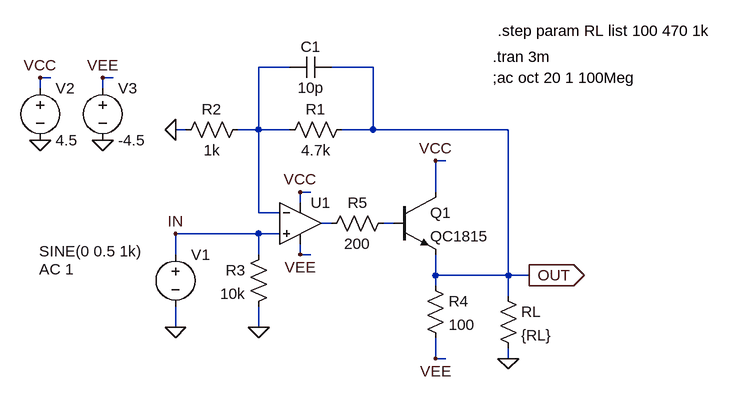
[diagram p0: schematic EmitterFollower+OPAMP+R.asc]
EmitterFollower+OPAMP+R.asc, the LTspice schematic file:
Version 4
SHEET 1 880 680
WIRE 128 -64 80 -64
WIRE 256 -64 192 -64
WIRE -240 -48 -256 -48
WIRE -144 -48 -160 -48
WIRE -256 -32 -256 -48
WIRE -160 -32 -160 -48
WIRE -32 32 -48 32
WIRE 80 32 80 -64
WIRE 80 32 48 32
WIRE 128 32 80 32
WIRE 256 32 256 -64
WIRE 256 32 208 32
WIRE 464 32 256 32
WIRE 368 80 352 80
WIRE 160 128 144 128
WIRE 352 128 352 80
WIRE 144 144 144 128
WIRE 80 160 80 32
WIRE 112 160 80 160
WIRE 192 176 176 176
WIRE 288 176 272 176
WIRE 80 192 -48 192
WIRE 112 192 80 192
WIRE -48 224 -48 192
WIRE 80 224 80 192
WIRE 144 224 144 208
WIRE 160 224 144 224
WIRE 352 256 352 224
WIRE 464 256 464 32
WIRE 464 256 352 256
WIRE 496 256 464 256
WIRE 352 272 352 256
WIRE 464 288 464 256
WIRE -48 336 -48 304
WIRE 80 336 80 304
WIRE 352 384 352 352
WIRE 368 384 352 384
WIRE 464 384 464 368
FLAG 144 224 VEE
FLAG -48 32 0
FLAG 144 128 VCC
FLAG 352 384 VEE
FLAG 80 336 0
FLAG 496 256 OUT
IOPIN 496 256 Out
FLAG 464 384 0
FLAG -48 336 0
FLAG -48 192 IN
FLAG -256 -48 VCC
FLAG -160 -48 VEE
FLAG -256 48 0
FLAG -160 48 0
FLAG 352 80 VCC
SYMBOL Opamps\\UniversalOpamp2 144 176 R0
SYMATTR InstName U1
SYMBOL res 64 16 R90
WINDOW 0 0 56 VBottom 2
WINDOW 3 32 56 VTop 2
SYMATTR InstName R2
SYMATTR Value 1k
SYMBOL res 112 48 R270
WINDOW 0 32 56 VTop 2
WINDOW 3 0 56 VBottom 2
SYMATTR InstName R1
SYMATTR Value 4.7k
SYMBOL npn 288 128 R0
SYMATTR InstName Q1
SYMATTR Value QC1815
SYMBOL res 336 256 R0
SYMATTR InstName R4
SYMATTR Value 100
SYMBOL cap 192 -48 M270
WINDOW 0 32 32 VTop 2
WINDOW 3 0 32 VBottom 2
SYMATTR InstName C1
SYMATTR Value 10p
SYMBOL res 96 208 M0
SYMATTR InstName R3
SYMATTR Value 10k
SYMBOL res 448 272 R0
SYMATTR InstName RL
SYMATTR Value {RL}
SYMBOL voltage -48 208 R0
WINDOW 3 -210 11 Left 2
WINDOW 123 -210 39 Left 2
WINDOW 39 0 0 Left 2
SYMATTR Value SINE(0 0.5 1k)
SYMATTR Value2 AC 1
SYMATTR InstName V1
SYMBOL voltage -256 -48 R0
WINDOW 123 0 0 Left 2
WINDOW 39 0 0 Left 2
SYMATTR InstName V2
SYMATTR Value 4.5
SYMBOL voltage -160 -48 R0
WINDOW 123 0 0 Left 2
WINDOW 39 0 0 Left 2
SYMATTR InstName V3
SYMATTR Value -4.5
SYMBOL res 288 160 R90
WINDOW 0 0 56 VBottom 2
WINDOW 3 32 56 VTop 2
SYMATTR InstName R5
SYMATTR Value 200
TEXT 440 -80 Left 2 !.tran 3m
TEXT 440 -48 Left 2 !;ac oct 20 1 100Meg
TEXT 448 -120 Left 2 !.step param RL list 100 470 1k

The netlist it stands for:
* EmitterFollower+OPAMP+R.asc
XU1 IN N001 VCC VEE N002 level.2 Avol=1Meg GBW=10Meg Slew=10Meg ilimit=25m rail=0 Vos=0 phimargin=45 en=0 enk=0 in=0 ink=0 Rin=500Meg  ; pins IN+ IN- V+ V- OUT
R2 N001 0 1k
R1 N001 OUT 4.7k
Q1 VCC N003 OUT 0 QC1815
R4 OUT VEE 100
C1 OUT N001 10p
R3 IN 0 10k
RL OUT 0 {RL}
V1 IN 0 SINE(0 0.5 1k) AC 1
V2 VCC 0 4.5
V3 VEE 0 -4.5
R5 N003 N002 200
.model NPN NPN
.model PNP PNP
.lib standard.bjt
.tran 3m
;ac oct 20 1 100Meg
.step param RL list 100 470 1k
.lib UniversalOpamps2.sub
.backanno
.end